# Altium schematic sheet Buck_Converter.SchDoc
size A4; SheetNumber: 7; SheetTotal: 9
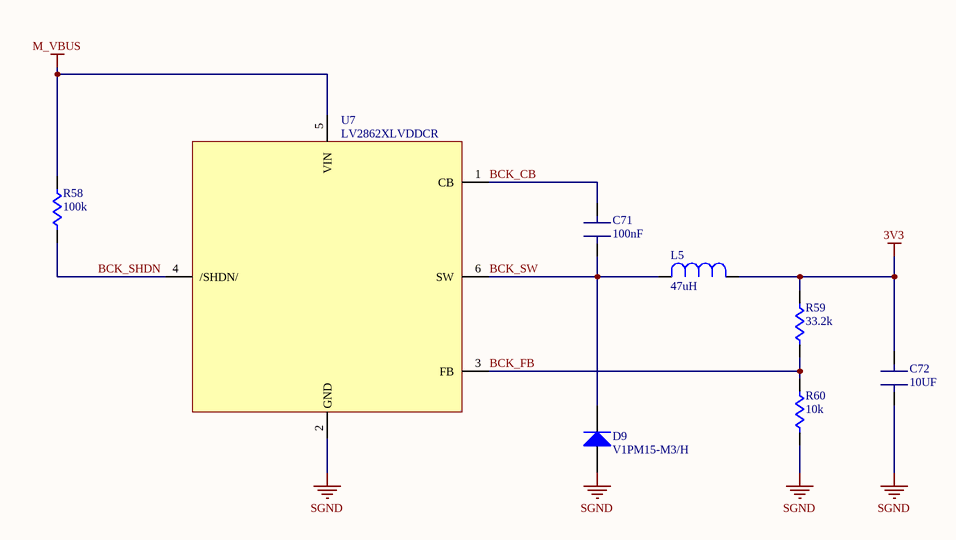
[diagram p0: Buck_Converter.SchDoc]

## Parts
C71  100nF  [CAP: 0603]
C72  10UF  [CAP: 0805]
D9  V1PM15-M3/H  [DO-219AD-2]
L5  47uH  [MDH6045C]
R58  100k  [RES: 0603]
R59  33.2k  [RES: 0603]
R60  10k  [RES: 0603]
U7  LV2862XLVDDCR  [SOT23-6]

## Nets
3V3: C72.2(B) L5.2 R59.2
M_VBUS: R58.2 U7.5(VIN)
SGND: C72.1(A) D9.2(A) R60.1 U7.2(GND)
BCK_CB: C71.2(B) U7.1(CB)
BCK_FB: R59.1 R60.2 U7.3(FB)
BCK_SHDN: R58.1 U7.4(/SHDN/)
BCK_SW: C71.1(A) D9.1(K) L5.1 U7.6(SW)

## Notes on the sheet
- Size:
- Date:
- Sheet Name:
- A4
- Sheet
- Time:
- of
- Author :
- Hatim Saad
- Project:
- File:

## Library data of the parts
C71 = CAP 0603: CAP SMD 0603
C72 = CAP 0805: CAP SMD 0805
D9 = V1PM15-M3/H: Schottky Diodes & Rectifiers 150V 1A TMBS MicroSMP; Supplier 1: Mouser; Supplier Part Number 1: 78-V1PM15-M3/H
L5 = MDH6045C-470MA=P3: Power Inductors - SMD 47uH 208mOhms 20 % 1A AEC-Q200; Supplier 1: Mouser; Supplier Part Number 1: 81-MDH6045C-470MA=P3
R58-R60 = RES 0603: RES SMD 0603
U7 = LV2862XLVDDCR: Switching Voltage Regulators 4.5-V to 60-V 600-m A buck converter in A 595-LV2862XLVDDCT; Supplier 1: Mouser; Supplier Part Number 1: 595-LV2862XLVDDCR